# EAGLE design PCB 1d (EAGLE 9.0.1)
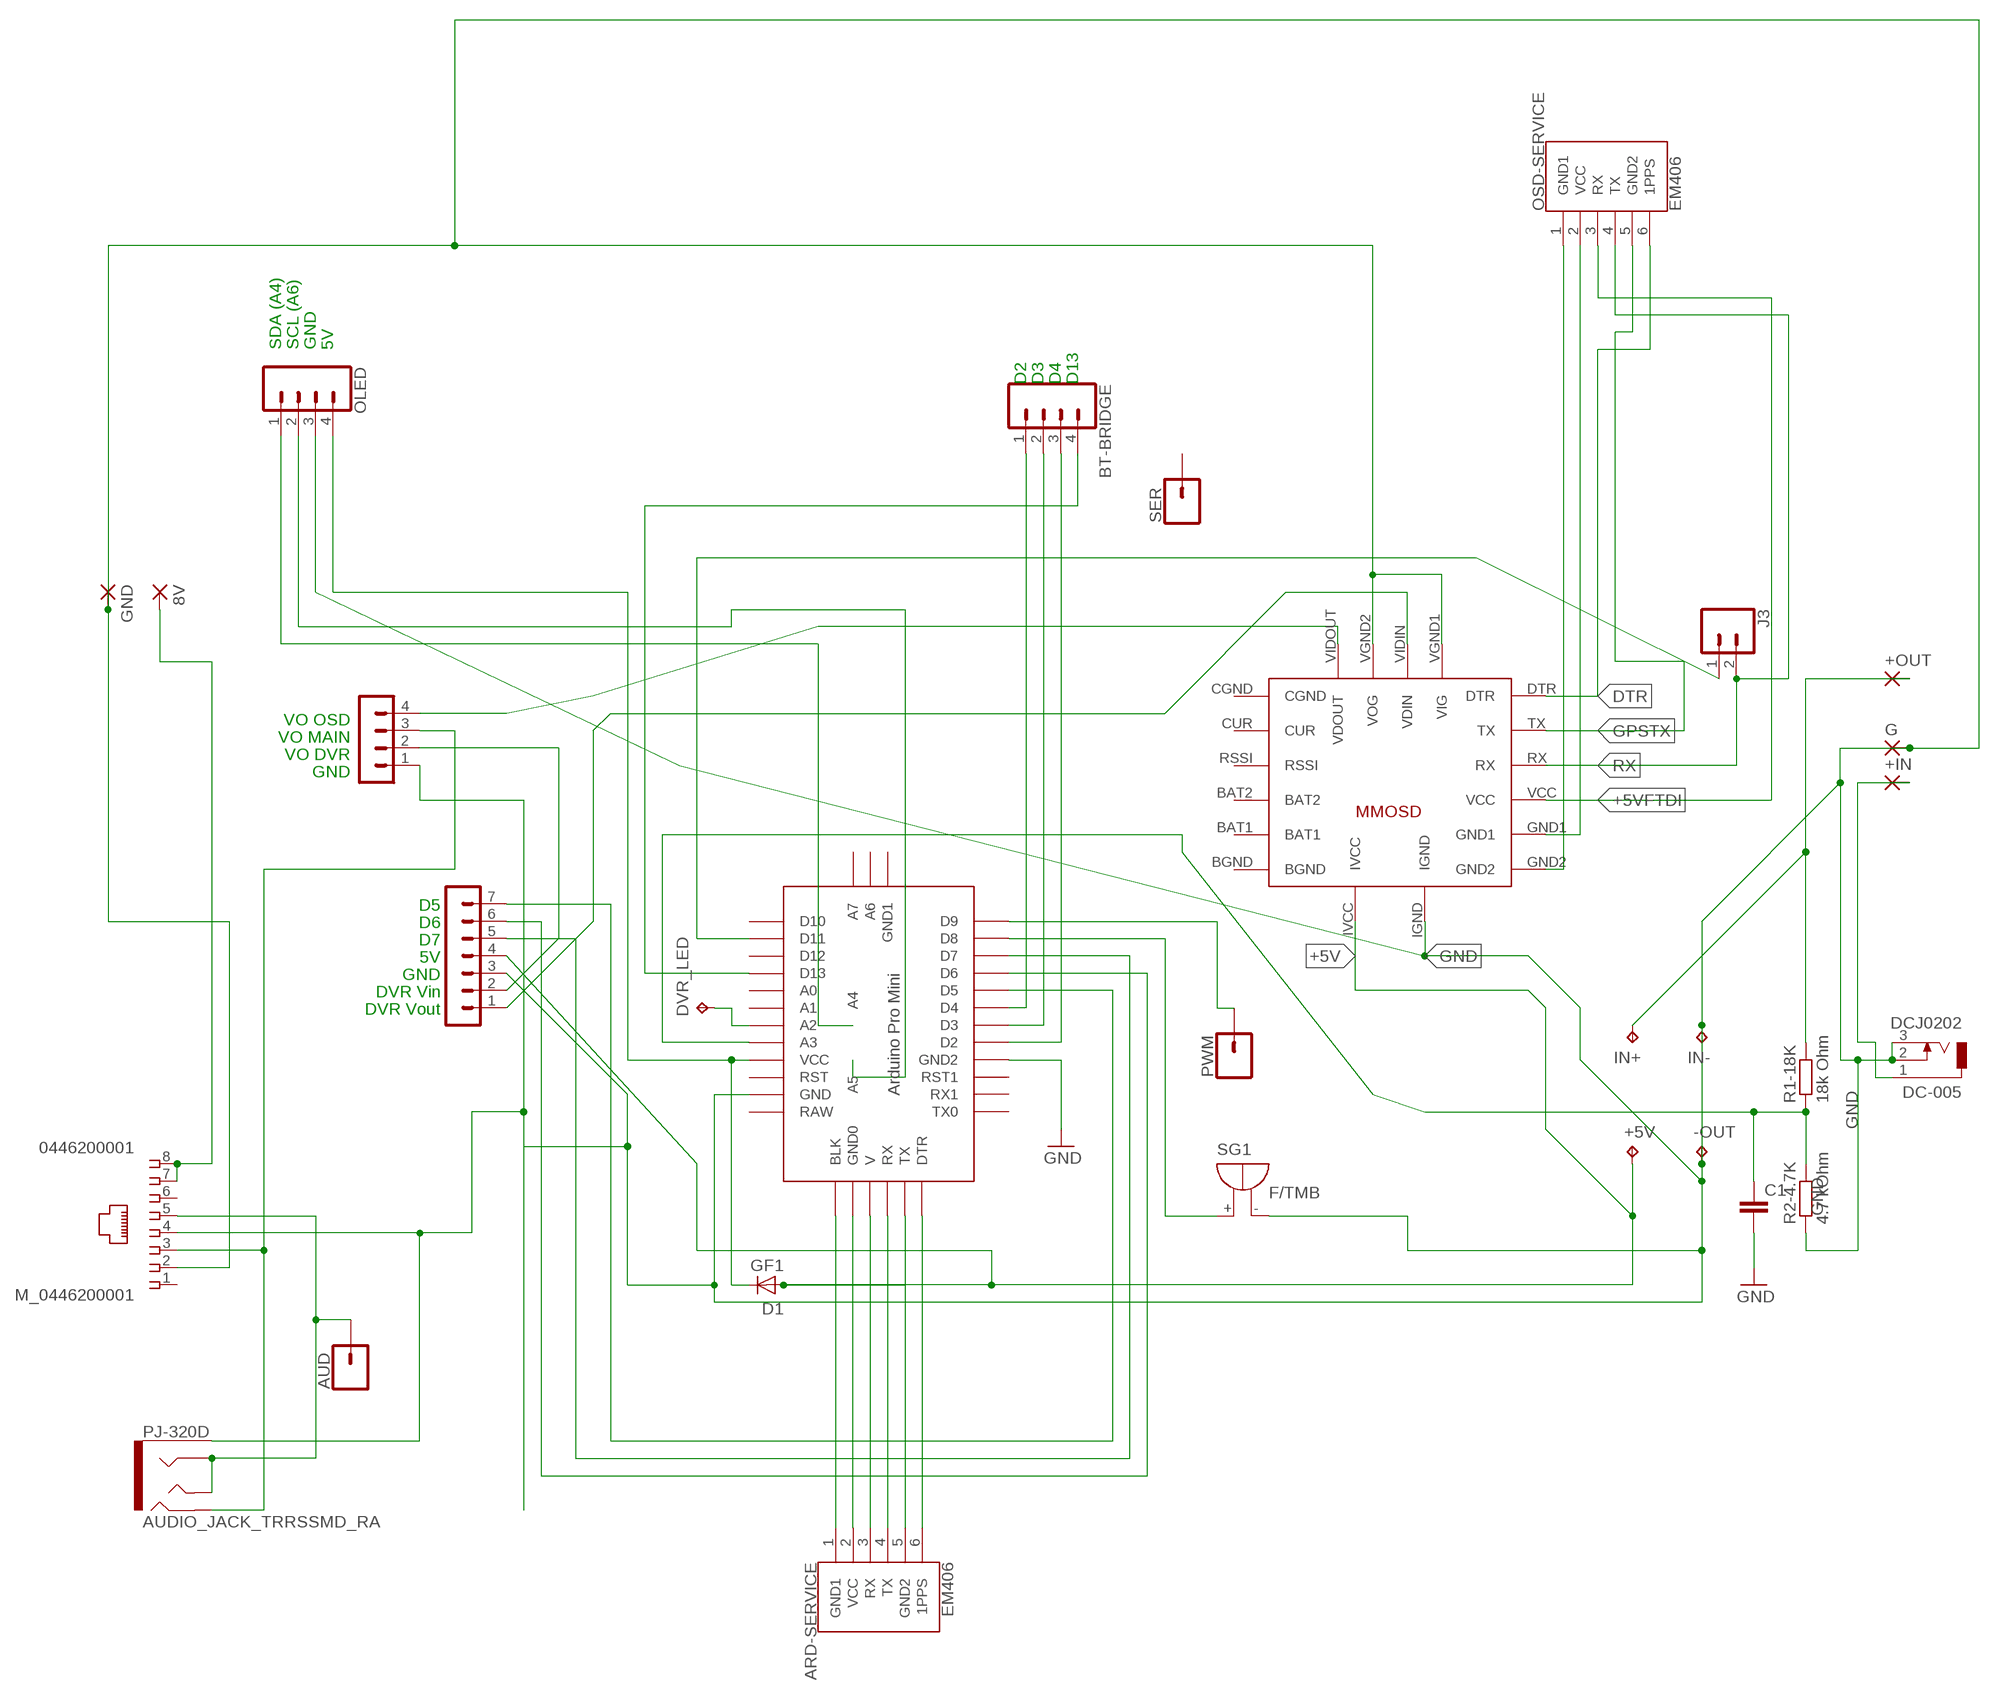
[diagram p0: schematic, sheet 1]

## Parts
8V  2,54/1,1  [2,54/1,1]
+5V  TPTP20SQ  [TP20SQ]
+IN  2,54/1,1  [2,54/1,1]
+OUT  2,54/1,1  [2,54/1,1]
-OUT  TPTP20SQ  [TP20SQ]
ARD-SERVICE  EM406  [1X06-1MM]
AUD  CONN_01  [1X01]
BT-BRIDGE  CONN_04  [1X04]
C1  C-EUC1206K  [C1206K]
D1  GF1  [SMA-DO214AC]
DC-005  DCJ0202  [DCJ0202]
DVR_LED  TPTP20SQ  [TP20SQ]
G  2,54/1,1  [2,54/1,1]
GND  2,54/1,1  [2,54/1,1]
IN+  TPTP20SQ  [TP20SQ]
IN-  TPTP20SQ  [TP20SQ]
J3  CONN_02  [1X02]
M_0446200001  0446200001  [0446200001]
MINIMOSD  MICROMINIMOSDPWR  [MMOSDNVDVID]
MODULE-IO  MA07-1  [MA07-1]
OLED  CONN_04  [1X04]
OSD-SERVICE  EM406  [1X06-1MM]
PJ-320D  AUDIO_JACK_TRRSSMD_RA  [AUDIO_JACK_3.5MM_TRRS_SMD_RA]
PWM  CONN_01  [1X01]
R1-18K  18k Ohm  R-EU_M1206  [M1206]
R2-4.7K  4.7 kOhm  R-EU_M1206  [M1206]
SER  CONN_01  [1X01]
SG1  F/TMB  [F/TMB]
U$1  ABK-PRO-MINI  [ABK-PRO-MINI]
V-IO  MA04-1  [MA04-1]

## Nets
8V: 8V.1(P) M_0446200001.7 M_0446200001.8
+: +IN.1(P) DC-005.1
+5V: +5V.TP D1.A MINIMOSD.IVCC MODULE-IO.4
+5VFTDI [thin]: MINIMOSD.VCC OSD-SERVICE.3(RX)
AUDIO [medium]: AUD.1 M_0446200001.5 PJ-320D.RING1 PJ-320D.TIP
BEC-5V: D1.K(C) OLED.4 U$1.VCC
BUTTON1 [thin]: BT-BRIDGE.3 U$1.D2
BUTTON2 [thin]: BT-BRIDGE.2 U$1.D3
BUTTON3 [thin]: BT-BRIDGE.1 U$1.D4
BUZZER [thin]: SG1.+ U$1.D8
D5 [thin]: MODULE-IO.7 U$1.D5
D6 [thin]: MODULE-IO.6 U$1.D6
D7 [thin]: MODULE-IO.5 U$1.D7
D9PWM [thin]: PWM.1 U$1.D9
D11-RX [thin]: J3.1 U$1.D11
DTR [thin]: MINIMOSD.DTR OSD-SERVICE.6(1PPS)
DVRVIDEO-IN [medium]: MODULE-IO.2 V-IO.2
GND [d_cl]: -OUT.TP C1.2 DC-005.2 DC-005.3 G.1(P) GND.1(P) IN-.TP M_0446200001.2 M_0446200001.4 MINIMOSD.IGND MINIMOSD.VGND1(VIG) MINIMOSD.VGND2(VOG) MODULE-IO.3 OLED.3 PJ-320D.EARTH R2-4.7K.1 SG1.- U$1.GND U$1.GND1(GND2) V-IO.1
GPSTX [thin]: MINIMOSD.TX OSD-SERVICE.5(GND2)
LED [thin]: BT-BRIDGE.4 U$1.D13
N$1: DVR_LED.TP U$1.A1(A2)
N$3 [d_cl]: MINIMOSD.GND1 OSD-SERVICE.2(VCC)
N$5: MINIMOSD.GND2 OSD-SERVICE.1(GND1)
N$16 [thin]: ARD-SERVICE.1(GND1) U$1.BLK
N$18 [thin]: ARD-SERVICE.2(VCC) U$1.G(GND0)
N$19 [thin]: ARD-SERVICE.3(RX) U$1.5V(V)
N$21 [thin]: ARD-SERVICE.5(GND2) U$1.TX01(TX)
N$22 [thin]: ARD-SERVICE.6(1PPS) U$1.DTR
OSDSIGNAL [medium]: MINIMOSD.VIDOUT(VDOUT) V-IO.4
RAWVIDEO_MODULE [medium]: MINIMOSD.VIDIN(VDIN) MODULE-IO.1
RX [thin]: J3.2 MINIMOSD.RX OSD-SERVICE.4(TX)
SCL [thin]: OLED.2 U$1.A5
SDA [thin]: OLED.1 U$1.A4
V [thin]: ARD-SERVICE.4(TX) U$1.RX01(RX)
VCC: +OUT.1(P) IN+.TP R1-18K.2
VMAIN [medium]: M_0446200001.3 PJ-320D.RING2 V-IO.3
VSENS: C1.1 R1-18K.1 R2-4.7K.2 U$1.A0(A3)
Unconnected: M_0446200001.1 M_0446200001.6 MINIMOSD.CUR MINIMOSD.RSSI SER.1 U$1.A2(A1) U$1.A3(A0) U$1.A6 U$1.A7 U$1.D10 U$1.D12 U$1.GND4(GND1) U$1.RAW U$1.RST U$1.RST1 U$1.RX1 U$1.TX0

## Notes on the sheet
- SDA (A4) | SCL (A6) | GND | 5V
- D2 | D3 | D4 | D13
- VO OSD
- VO MAIN
- VO DVR
- GND
- D5
- D6
- D7
- 5V
- GND
- DVR Vin
- DVR Vout

## Power pins joined to a net without a drawn wire
BAT1: MINIMOSD.BAT1
BAT2: MINIMOSD.BAT2
BGND: MINIMOSD.BGND
CGND: MINIMOSD.CGND

## Library data of the parts
8V +IN +OUT G GND = wirepad:2,54/1,1: THROUGH-HOLE PAD
+5V -OUT DVR_LED IN+ IN- = testpad:TP: Test pad
ARD-SERVICE OSD-SERVICE = SparkFun-Connectors:EM406: EM406 GPS Connector Here is a six pin vertical 1.0mm pitch connector. It is useful if you need something very tiny as a connection. These are not the standard JST type connectors we use on most of our boards, but are actually the much smaller JST-SH type. Here is the connector we sell at SparkFun: JST SH Vertical 6-Pin Connector - SMD <https://www.sparkfun.com/products/579> (GPS-00579) Datasheet <http://www.sparkfun.com/datasheets/GPS/EM406-SMDConnector-eSH.pdf> It was used on these SparkFun products: SparkFun GPS Breakout <https://www.sparkfun.com/products/11818> (BOB-11818) SparkFun Weather Shield <https://www.sparkfun.com/products/12081> (DEV-12081) And many, many other GPS related products.; PROD_ID: CONN-08249; SF_ID: GPS-00579
AUD PWM SER = SparkFun-Connectors:CONN_01: Single connection point. Often used as Generic Header-pin footprint for 0.1 inch spaced/style header connections On any of the 0.1 inch spaced packages, you can populate with these: Break Away Headers - Straight <https://www.sparkfun.com/products/116> (PRT-00116) Break Away Male Headers - Right Angle <https://www.sparkfun.com/products/553> (PRT-00553) Female Headers <https://www.sparkfun.com/products/115> (PRT-00115) Break Away Headers - Machine Pin <https://www.sparkfun.com/products/117> (PRT-00117) Break Away Female Headers - Swiss Machine Pin <https://www.sparkfun.com/products/743> (PRT-00743) This device is also useful as a general connection point to wire up your design to another part of your project. Our various solder wires solder well into these plated through hole pads. Hook-Up Wire - Assortment (Stranded, 22 AWG) <https://www.sparkfun.com/products/11375> (PRT-11375) Hook-Up Wire - Assortment (Solid Core, 22 AWG) <https://www.sparkfun.com/products/11367> (PRT-11367) View the entire wire category on our website here <https://www.sparkfun.com/categories/141> Special notes: SMTSO-256-ET is a "flush mount" nut for a 4-40 screw. We mostly use this on specialty testbeds; it is a nice way to connect hardware to your PCB at an adjustable hieght. Also note, the SNAP packages are for using a snappable style connector. We sell a baggie of snaps and they are also used on two LilyPad designs: Snap Assortment - 30 pack (male and female) <https://www.sparkfun.com/products/11347> (DEV-11347) LilyPad Arduino SimpleSnap <https://www.sparkfun.com/products/10941> (DEV-10941) LilyPad SimpleSnap Protoboard <https://www.sparkfun.com/products/10940> (DEV-10940)
BT-BRIDGE OLED = SparkFun-Connectors:CONN_04: Multi connection point. Often used as Generic Header-pin footprint for 0.1 inch spaced/style header connections On any of the 0.1 inch spaced packages, you can populate with these: Break Away Headers - Straight <https://www.sparkfun.com/products/116> (PRT-00116) Break Away Male Headers - Right Angle <https://www.sparkfun.com/products/553> (PRT-00553) Female Headers <https://www.sparkfun.com/products/115> (PRT-00115) Break Away Headers - Machine Pin <https://www.sparkfun.com/products/117> (PRT-00117) Break Away Female Headers - Swiss Machine Pin <https://www.sparkfun.com/products/743> (PRT-00743) For SCREWTERMINALS and SPRING TERMINALS visit here: Screw Terimnals on SparkFun.com <https://www.sparkfun.com/search/results?term=Screw+Terminals> (5mm/3.5mm/2.54mm spacing) This device is also useful as a general connection point to wire up your design to another part of your project. Our various solder wires solder well into these plated through hole pads. Hook-Up Wire - Assortment (Stranded, 22 AWG) <https://www.sparkfun.com/products/11375> (PRT-11375) Hook-Up Wire - Assortment (Solid Core, 22 AWG) <https://www.sparkfun.com/products/11367> (PRT-11367) View the entire wire category on our website here <https://www.sparkfun.com/categories/141> Special notes: Molex polarized connector foot print use with SKU : PRT-08231 with associated crimp pins and housings. 1MM SMD Version SKU: PRT-10208; PROD_ID: CONN-09696
C1 = rcl:C-EU: CAPACITOR, European symbol; SPICEPREFIX: C
D1 = diode:GF1: DIODE
DC-005 = con-jack:DCJ0202: DC POWER JACK Source: DCJ0202.pdf; OC_FARNELL: unknown; OC_NEWARK: unknown
J3 = SparkFun-Connectors:CONN_02: Multi connection point. Often used as Generic Header-pin footprint for 0.1 inch spaced/style header connections On any of the 0.1 inch spaced packages, you can populate with these: Break Away Headers - Straight <https://www.sparkfun.com/products/116> (PRT-00116) Break Away Male Headers - Right Angle <https://www.sparkfun.com/products/553> (PRT-00553) Female Headers <https://www.sparkfun.com/products/115> (PRT-00115) Break Away Headers - Machine Pin <https://www.sparkfun.com/products/117> (PRT-00117) Break Away Female Headers - Swiss Machine Pin <https://www.sparkfun.com/products/743> (PRT-00743) For SCREWTERMINALS and SPRING TERMINALS visit here: Screw Terimnals on SparkFun.com <https://www.sparkfun.com/search/results?term=Screw+Terminals> (5mm/3.5mm/2.54mm spacing) This device is also useful as a general connection point to wire up your design to another part of your project. Our various solder wires solder well into these plated through hole pads. Hook-Up Wire - Assortment (Stranded, 22 AWG) <https://www.sparkfun.com/products/11375> (PRT-11375) Hook-Up Wire - Assortment (Solid Core, 22 AWG) <https://www.sparkfun.com/products/11367> (PRT-11367) View the entire wire category on our website here <https://www.sparkfun.com/categories/141> Special notes: Molex polarized connector foot print use with: PRT-08233 with associated crimp pins and housings. 2.54_SCREWTERM for use with PRT-10571. 3.5mm Screw Terminal footprints for PRT-08084 5mm Screw Terminal footprints for use with PRT-08432
M_0446200001 = con-molex:0446200001: RJ-45 INVERTED MODULAR JACK ASSEMBLY WITH RJ-11 KEEPOUT FEATURE Source: Data sheet <http://www.farnell.com/datasheets/73207.pdf>; MF: MOLEX; OC_FARNELL: unknown
MINIMOSD = FPVTools:MICROMINIMOSDPWR
MODULE-IO = con-lstb:MA07-1: PIN HEADER; OC_FARNELL: unknown; OC_NEWARK: unknown
PJ-320D = SparkFun-Connectors:AUDIO_JACK_TRRS: Audio Jack - 3.5mm TRRS (SMD) This is a 3.5mm TRRS SMD audio jack. TRRS connectors are the audio-style connectors that you see on some phones, MP3 players and development boards. TRRS stands for “tip, ring, ring, sleeve,” which reflects that this has three conductors and a ground. SparkFun Products: Audio Jack <https://www.sparkfun.com/products/12639> mbed Starter Kit <https://www.sparkfun.com/products/12968> SparkFun TRRS 3.5mm Jack Breakout <https://www.sparkfun.com/products/11570>; PROD_ID: CONN-10676; SF_ID: PRT-12639
R1-18K R2-4.7K = rcl:R-EU_: RESISTOR, European symbol; SPICEPREFIX: R
SG1 = buzzer:F/TMB: BUZZER Source: Buerklin; OC_FARNELL: unknown; OC_NEWARK: unknown
U$1 = Arduino-clone:ABK-PRO-MINI: ABK Pro-Mini Arduino Clone
V-IO = con-lstb:MA04-1: PIN HEADER; OC_FARNELL: unknown; OC_NEWARK: unknown

## Net classes
0 default: width 0.762 mm, drill 0.508 mm, clearance 0.508 mm
1 thin: width 0.4 mm, drill 0.3 mm, clearance 0.3 mm
2 medium: width 0.5 mm, drill 0.4 mm, clearance 0.3 mm
3 d_cl: width 0.762 mm, drill 0.508 mm, clearance 0.3 mm

## Board
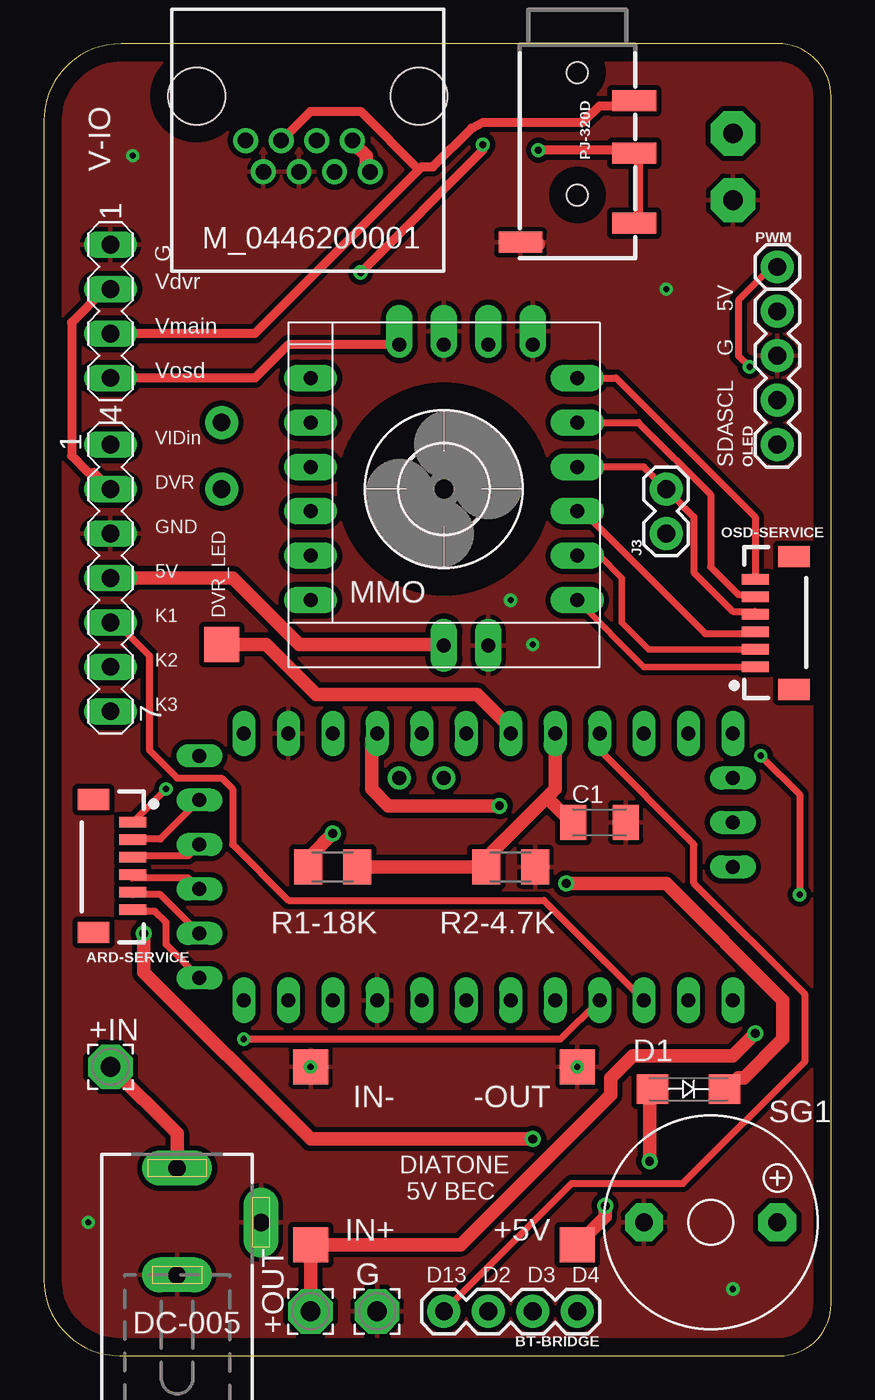
[diagram p1: board, top side]
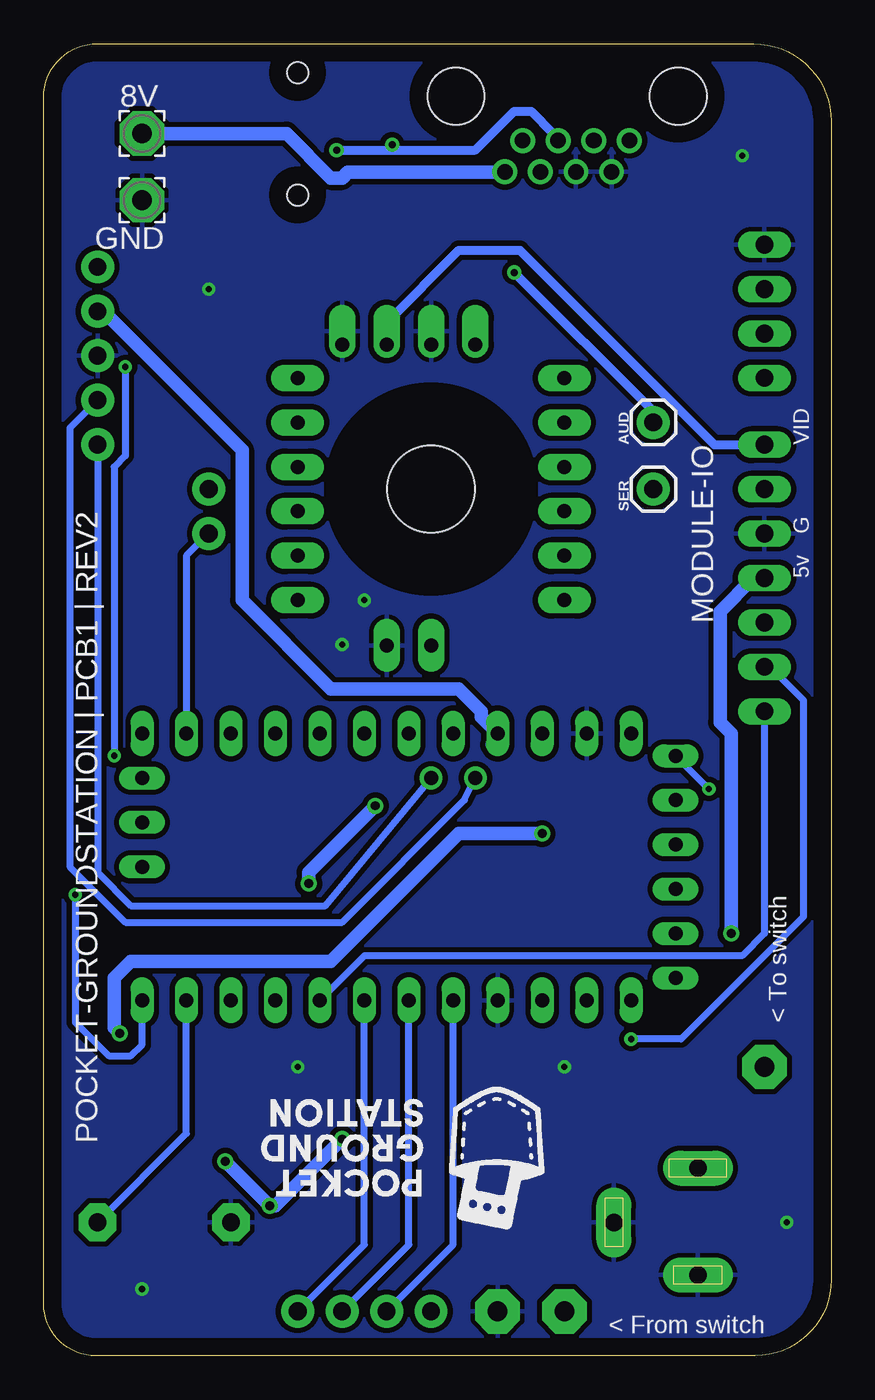
[diagram p2: board, bottom side, seen from below]

Size 44.98 x 74.98 mm. Coordinates in mm from the lower left corner, seen from the top.
Outline: 41.94,74.98 4.42,74.98 arc90 0,70.56 0,4.34 arc90 4.34,0 42.02,0 arc90 44.98,2.97 44.98,71.94 arc90 41.94,74.98
Copper layers (1*16): Top 0.035mm / dielectric 1.5mm / Bottom 0.035mm
Design rules "PCB Albert *": minimum track width 0.15mm, minimum drill 0.35mm, track to track 0.205mm, track to pad 0.205mm, pad to pad 0.205mm, via to via 0.205mm, smd to smd 6mil, copper to edge 40mil, drill to drill 6mil, minimum pad ring 10mil, minimum via ring 8mil, stop-mask expansion 4mil, vias tented up to drill 2mm, thermal gap 10mil

### Footprints (pad centres in the part's own frame; a part is rotated, then mirrored left to right if it is on the bottom)
2,54/1,1 = drill 1.118 pad 2.54 octagon: 1 0,0
TP20SQ = smd 2 x 2: TP 0,0
1X06-1MM = smd 0.6 x 1.55: 1 -2.54,1.27; 2 -1.54,1.27; 3 -0.54,1.27; 4 0.46,1.27; 5 1.46,1.27; 6 2.46,1.27 | smd 1.2 x 1.8: P$1 -3.84,-0.955; P$2 3.76,-0.955
1X01 = drill 1.016 pad 1.88: 1 0,0
1X04 = drill 1.016 pad 1.88: 1 0,0; 2 2.54,0; 3 5.08,0; 4 7.62,0
C1206K = smd 1.5 x 2: 1 -1.5,0; 2 1.5,0
SMA-DO214AC = smd 1.8 x 1.7: A -2.05,0; K 2.05,0
DCJ0202 = drill 1 pad 2 long: 1 0,3.1; 2 4.8,0; 3 0,-3
1X02 = drill 1.016 pad 1.88: 1 0,0; 2 2.54,0
0446200001 = drill 0.889 pad 1.422: 1 3.556,2.54; 2 2.54,4.318; 3 1.524,2.54; 4 0.508,4.318; 5 -0.508,2.54; 6 -1.524,4.318; 7 -2.54,2.54; 8 -3.556,4.318 | hole 3.251: 6.35,0; -6.35,0
MMOSDNVDVID = drill 0.8 pad 1.524 long: BAT1 -7.62,-3.81; BAT2 -7.62,-1.27; BGND -7.62,-6.35; CGND -7.62,3.81; CUR -7.62,6.35; DTR 7.62,6.35; GND1 7.62,-3.81; GND2 7.62,-6.35; IGND 2.54,-8.93; IVCC 0,-8.93; RSSI -7.62,1.27; RX 7.62,1.27; TX 7.62,3.81; VCC 7.62,-1.27 | drill 0.8 pad 1.524 offset: VGND1 0,8.255; VGND2 5.08,8.255; VIDIN 2.54,8.255; VIDOUT -2.54,8.255
MA07-1 = drill 1.016 long: 1 -7.62,0; 2 -5.08,0; 3 -2.54,0; 4 0,0; 5 2.54,0; 6 5.08,0; 7 7.62,0
AUDIO_JACK_3.5MM_TRRS_SMD_RA = smd 1.2 x 2.5: EARTH 11.3,-3.25; RING1 6.2,3.25; RING2 3.2,3.25; TIP 10.2,3.25 | hole 1.2: 1.6,0; 8.6,0
M1206 = smd 1.6 x 2: 1 -1.4,0; 2 1.4,0
F/TMB = drill 1.016 pad 2.159 octagon: + 3.81,0; - -3.81,0
ABK-PRO-MINI = drill 0.8 long: 5V 3.81,8.89; A0 10.16,-11.43; A1 10.16,-8.89; A2 10.16,-6.35; A3 10.16,-3.81; A6 5.08,-21.59; A7 7.62,-21.59; BLK 8.89,8.89; D2 -5.08,-3.81; D3 -5.08,-6.35; D4 -5.08,-8.89; D5 -5.08,-11.43; D6 -5.08,-13.97; D7 -5.08,-16.51; D8 -5.08,-19.05; D9 -5.08,-21.59; D10 10.16,-21.59; D11 10.16,-19.05; D12 10.16,-16.51; D13 10.16,-13.97; DTR -3.81,8.89; G 6.35,8.89; GND 10.16,3.81; GND1 -5.08,-1.27; GND4 2.54,-21.59; RAW 10.16,6.35; RST 10.16,1.27; RST1 -5.08,1.27; RX01 1.27,8.89; RX1 -5.08,3.81; TX0 -5.08,6.35; TX01 -1.27,8.89; VCC 10.16,-1.27 | drill 0.8: A4 7.62,-5.08; A5 7.62,-2.54
5,0 = hole 5: 0,0
MA04-1 = drill 1.016 long: 1 -3.81,0; 2 -1.27,0; 3 1.27,0; 4 3.81,0

### Placement (x,y rotation side)
8V  39.37,69.85 0 bottom
+5V  30.48,6.35 0 top
+IN  3.81,16.51 270 top
+OUT  15.24,2.54 0 top
-OUT  30.48,16.51 180 top
ARD-SERVICE  3.81,27.94 270 top
AUD  10.16,53.34 90 bottom
BT-BRIDGE  30.48,2.54 180 top
C1  31.75,30.48 0 top
D1  36.83,15.24 0 top
DC-005  7.62,7.62 0 top
DVR_LED  10.16,40.64 270 top
G  19.05,2.54 0 top
GND  39.37,66.04 180 bottom
IN+  15.24,6.35 0 top
IN-  15.24,16.51 180 top
J3  35.56,46.99 90 top
M_0446200001  15.09,71.98 180 top
MINIMOSD  22.86,49.53 0 top
MODULE-IO  3.81,44.45 270 top
OLED  41.91,52.07 90 top
OSD-SERVICE  41.91,41.91 90 top
PJ-320D  30.48,74.93 270 top
PWM  41.91,62.23 0 top
R1-18K  16.51,27.94 180 top
R2-4.7K  26.67,27.94 180 top
SER  10.16,49.53 90 bottom
SG1  38.1,7.62 0 top
U$1  17.78,25.4 90 top
U$2  [5,0]  22.86,49.53 0 top
V-IO  3.81,59.69 270 top

### Tracks (layer width: path | path; a pad name or v marks a point on that pad's centre or on a via)
8V
  Top 0.762: M_0446200001.8 18.41,67.94 18.41,68.58 17.78,69.22 M_0446200001.7
  Bottom 0.762: 8V.1 31.11,69.85 28.57,67.31 27.94,67.31 27.62,67.63 18.73,67.63 M_0446200001.8
+
  Top 0.762: DC-005.1 7.62,12.7 +IN.1
+5V  (via drill 0.51)
  Top 0.762: v34.61,11.11 34.61,15.24 D1.A | v32.07,8.57 32.07,7.94 +5V.TP | MODULE-IO.4 10.79,44.45 14.61,40.64 22.86,40.64 MINIMOSD.IVCC | v27.94,12.38 15.24,12.38 5.71,21.91 v5.71,24.13
  Bottom 0.762: v34.61,11.11 v32.07,8.57 31.75,8.57 v27.94,12.38 | v5.71,24.13 5.71,35.56 6.35,36.2 6.35,42.55 4.45,44.45 MODULE-IO.4
+5VFTDI
  Top 0.4: MINIMOSD.VCC 30.8,48.26 37.78,41.27 40.64,41.27 OSD-SERVICE.3
AUDIO  (via drill 0.4)
  Top 0.5: v28.26,68.9 33.66,68.9 PJ-320D.RING1 33.97,68.58 33.97,64.77 PJ-320D.TIP 33.66,64.45 | v18.1,61.91 25.08,68.9 v25.08,69.22
  Bottom 0.5: v28.26,68.9 25.08,68.9 | 25.08,68.9 20.32,68.9 18.1,71.12 17.14,71.12 15.88,69.85 15.88,69.53 M_0446200001.5 | AUD.1 10.16,53.98 v18.1,61.91 | 25.08,68.9 v25.08,69.22
BEC-5V  (via drill 0.51)
  Top 0.762: v29.84,26.99 35.56,26.99 42.23,20.32 42.23,18.1 40.01,15.88 39.69,15.88 39.05,15.24 D1.K | v26.04,31.43 19.68,31.43 18.73,32.38 18.73,35.24 U$1.VCC
  Bottom 0.762: OLED.4 41.59,59.69 33.66,51.75 33.66,43.18 28.57,38.1 21.27,38.1 20,36.83 20,36.51 U$1.VCC 19.05,34.92 19.37,34.92 | v29.84,26.99 29.84,27.62 v26.04,31.43
BUTTON1
  Bottom 0.4: U$1.D2 21.59,6.35 BT-BRIDGE.3
BUTTON2
  Bottom 0.4: U$1.D3 24.13,6.35 BT-BRIDGE.2
BUTTON3
  Bottom 0.4: U$1.D4 26.67,6.35 BT-BRIDGE.1
BUZZER
  Bottom 0.4: U$1.D8 36.83,12.7 SG1.+
D5
  Bottom 0.4: U$1.D5 26.67,22.86 5.08,22.86 3.81,24.13 MODULE-IO.7
D6  (via drill 0.35)
  Top 0.4: U$1.D6 29.53,18.1 v11.43,18.1
  Bottom 0.4: v11.43,18.1 8.57,18.1 1.59,25.08 1.59,37.47 3.49,39.37 MODULE-IO.6
D7
  Top 0.4: U$1.D7 28.57,26.04 13.97,26.04 10.79,29.21 10.79,32.38 10.16,33.02 7.62,33.02 6.03,34.61 6.03,40.01 4.13,41.91 MODULE-IO.5
D9PWM  (via drill 0.35)
  Top 0.4: v43.18,26.35 43.18,32.07 v40.96,34.29 | v40.32,56.52 39.69,57.15 39.69,60.33 41.59,62.23 PWM.1
  Bottom 0.4: U$1.D9 39.37,17.78 40.01,17.14 41.27,17.14 43.18,19.05 v43.18,26.35 | v40.96,34.29 40.96,50.8 40.32,51.44 v40.32,56.52
D11-RX
  Bottom 0.4: U$1.D11 36.83,45.72 J3.1
DTR
  Top 0.4: OSD-SERVICE.6 40.64,47.94 32.7,55.88 MINIMOSD.DTR
DVRVIDEO-IN
  Top 0.5: MODULE-IO.2 2.86,50.48 2.54,50.48 1.59,51.44 1.59,59.05 3.49,60.96 V-IO.2
GND  (via drill 0.35)
  Top 0.762: 28.26,63.55 28.26,63.5 PJ-320D.EARTH
  other vias: 15.24,16.51 30.48,16.51 27.94,40.64 39.37,3.81 2.54,7.62 35.56,60.96 5.08,68.58 26.67,43.18
  pour Bottom: -1.27,76.2 -1.27,-1.27 45.72,-1.27 45.72,76.2
  pour Top: -2.54,77.47 46.99,77.47 46.99,-2.54 -2.54,-2.54
GPSTX
  Top 0.4: MINIMOSD.TX 33.97,53.34 38.1,49.21 38.1,45.09 39.69,43.5 40.64,43.5 OSD-SERVICE.5
LED
  Top 0.4: BT-BRIDGE.4 30.16,9.84 36.51,9.84 43.5,16.83 43.5,20.64 37.15,26.99 37.15,29.21 31.75,34.61 U$1.D13
N$1
  Top 0.762: DVR_LED.TP 12.7,40.64 15.56,37.78 24.77,37.78 26.67,35.88 U$1.A1
N$3
  Top 0.381: OSD-SERVICE.2 34.56,40.37 33.02,41.91 33.02,44.45 31.75,45.72 MINIMOSD.GND1
N$5
  Top 0.381: OSD-SERVICE.1 34.29,39.37 MINIMOSD.GND2
N$16  (via drill 0.35)
  Top 0.4: v6.99,32.38 ARD-SERVICE.1
  Bottom 0.4: U$1.BLK v6.99,32.38
N$18
  Top 0.4: U$1.G 6.67,29.53 5.08,29.53 ARD-SERVICE.2
N$19
  Top 0.4: U$1.5V 8.26,28.57 5.08,28.57 ARD-SERVICE.3
N$21
  Top 0.4: U$1.TX01 6.67,26.35 5.08,26.35 ARD-SERVICE.5
N$22
  Top 0.4: U$1.DTR 6.99,23.5 6.99,24.77 6.35,25.4 5.08,25.4 ARD-SERVICE.6
OSDSIGNAL
  Top 0.5: V-IO.4 12.06,55.88 13.97,57.78 MINIMOSD.VIDOUT
RAWVIDEO_MODULE
  Bottom 0.5: MODULE-IO.1 6.67,52.07 17.78,63.18 21.27,63.18 25.4,59.05 MINIMOSD.VIDIN
RX
  Top 0.4: OSD-SERVICE.4 40.64,42.55 39.37,42.55 37.15,44.77 37.15,47.94 J3.2 34.29,50.8 MINIMOSD.RX
SCL
  Bottom 0.4: U$1.A5 20.95,31.75 27.94,24.77 40.32,24.77 43.5,27.94 43.5,53.02 OLED.2
SDA
  Bottom 0.4: U$1.A4 28.89,25.72 40.01,25.72 41.91,27.62 OLED.1
V
  Top 0.4: U$1.RX01 8.26,27.3 5.08,27.3 ARD-SERVICE.4
VCC  (via drill 0.51)
  Top 0.762: +OUT.1 IN+.TP 23.81,6.35 32.38,14.92 32.38,15.88 33.66,17.14 39.37,17.14 v40.64,18.41 | v16.51,29.84 15.24,28.57 15.24,27.94 R1-18K.2
  Bottom 0.762: v16.51,29.84 21.27,29.84 28.57,22.54 40.01,22.54 40.96,21.59 40.96,18.73 v40.64,18.41
VMAIN
  Top 0.5: 21.43,67.79 18.1,71.12 15.24,71.12 M_0446200001.3 | V-IO.3 12.06,58.42 21.43,67.79 | PJ-320D.RING2 33.66,71.44 31.75,71.44 30.8,70.48 25.08,70.48 24.45,70.17 22.23,67.94 21.59,67.94 21.43,67.79
VSENS
  Top 0.762: R1-18K.1 R2-4.7K.2 25.08,28.26 28.73,31.91 | U$1.A0 29.21,32.38 28.73,31.91 | 28.73,31.91 30.16,30.48 C1.1

### Text on the board
tPlace: DIATONE / 5V BEC
tNames: G | Vdvr | 5V | Vmain | G | Vosd | SCL | VIDin | SDA | DVR | GND | 5V | K1 | K2 | K3 | D13 | D2 | D3 | D4
bNames: VID | POCKET-GROUNDSTATION | PCB1 | REV2 | G | 5v | < To switch | < From switch